# Altium schematic sheet Sheet1.SchDoc
size 420 x 297 mm
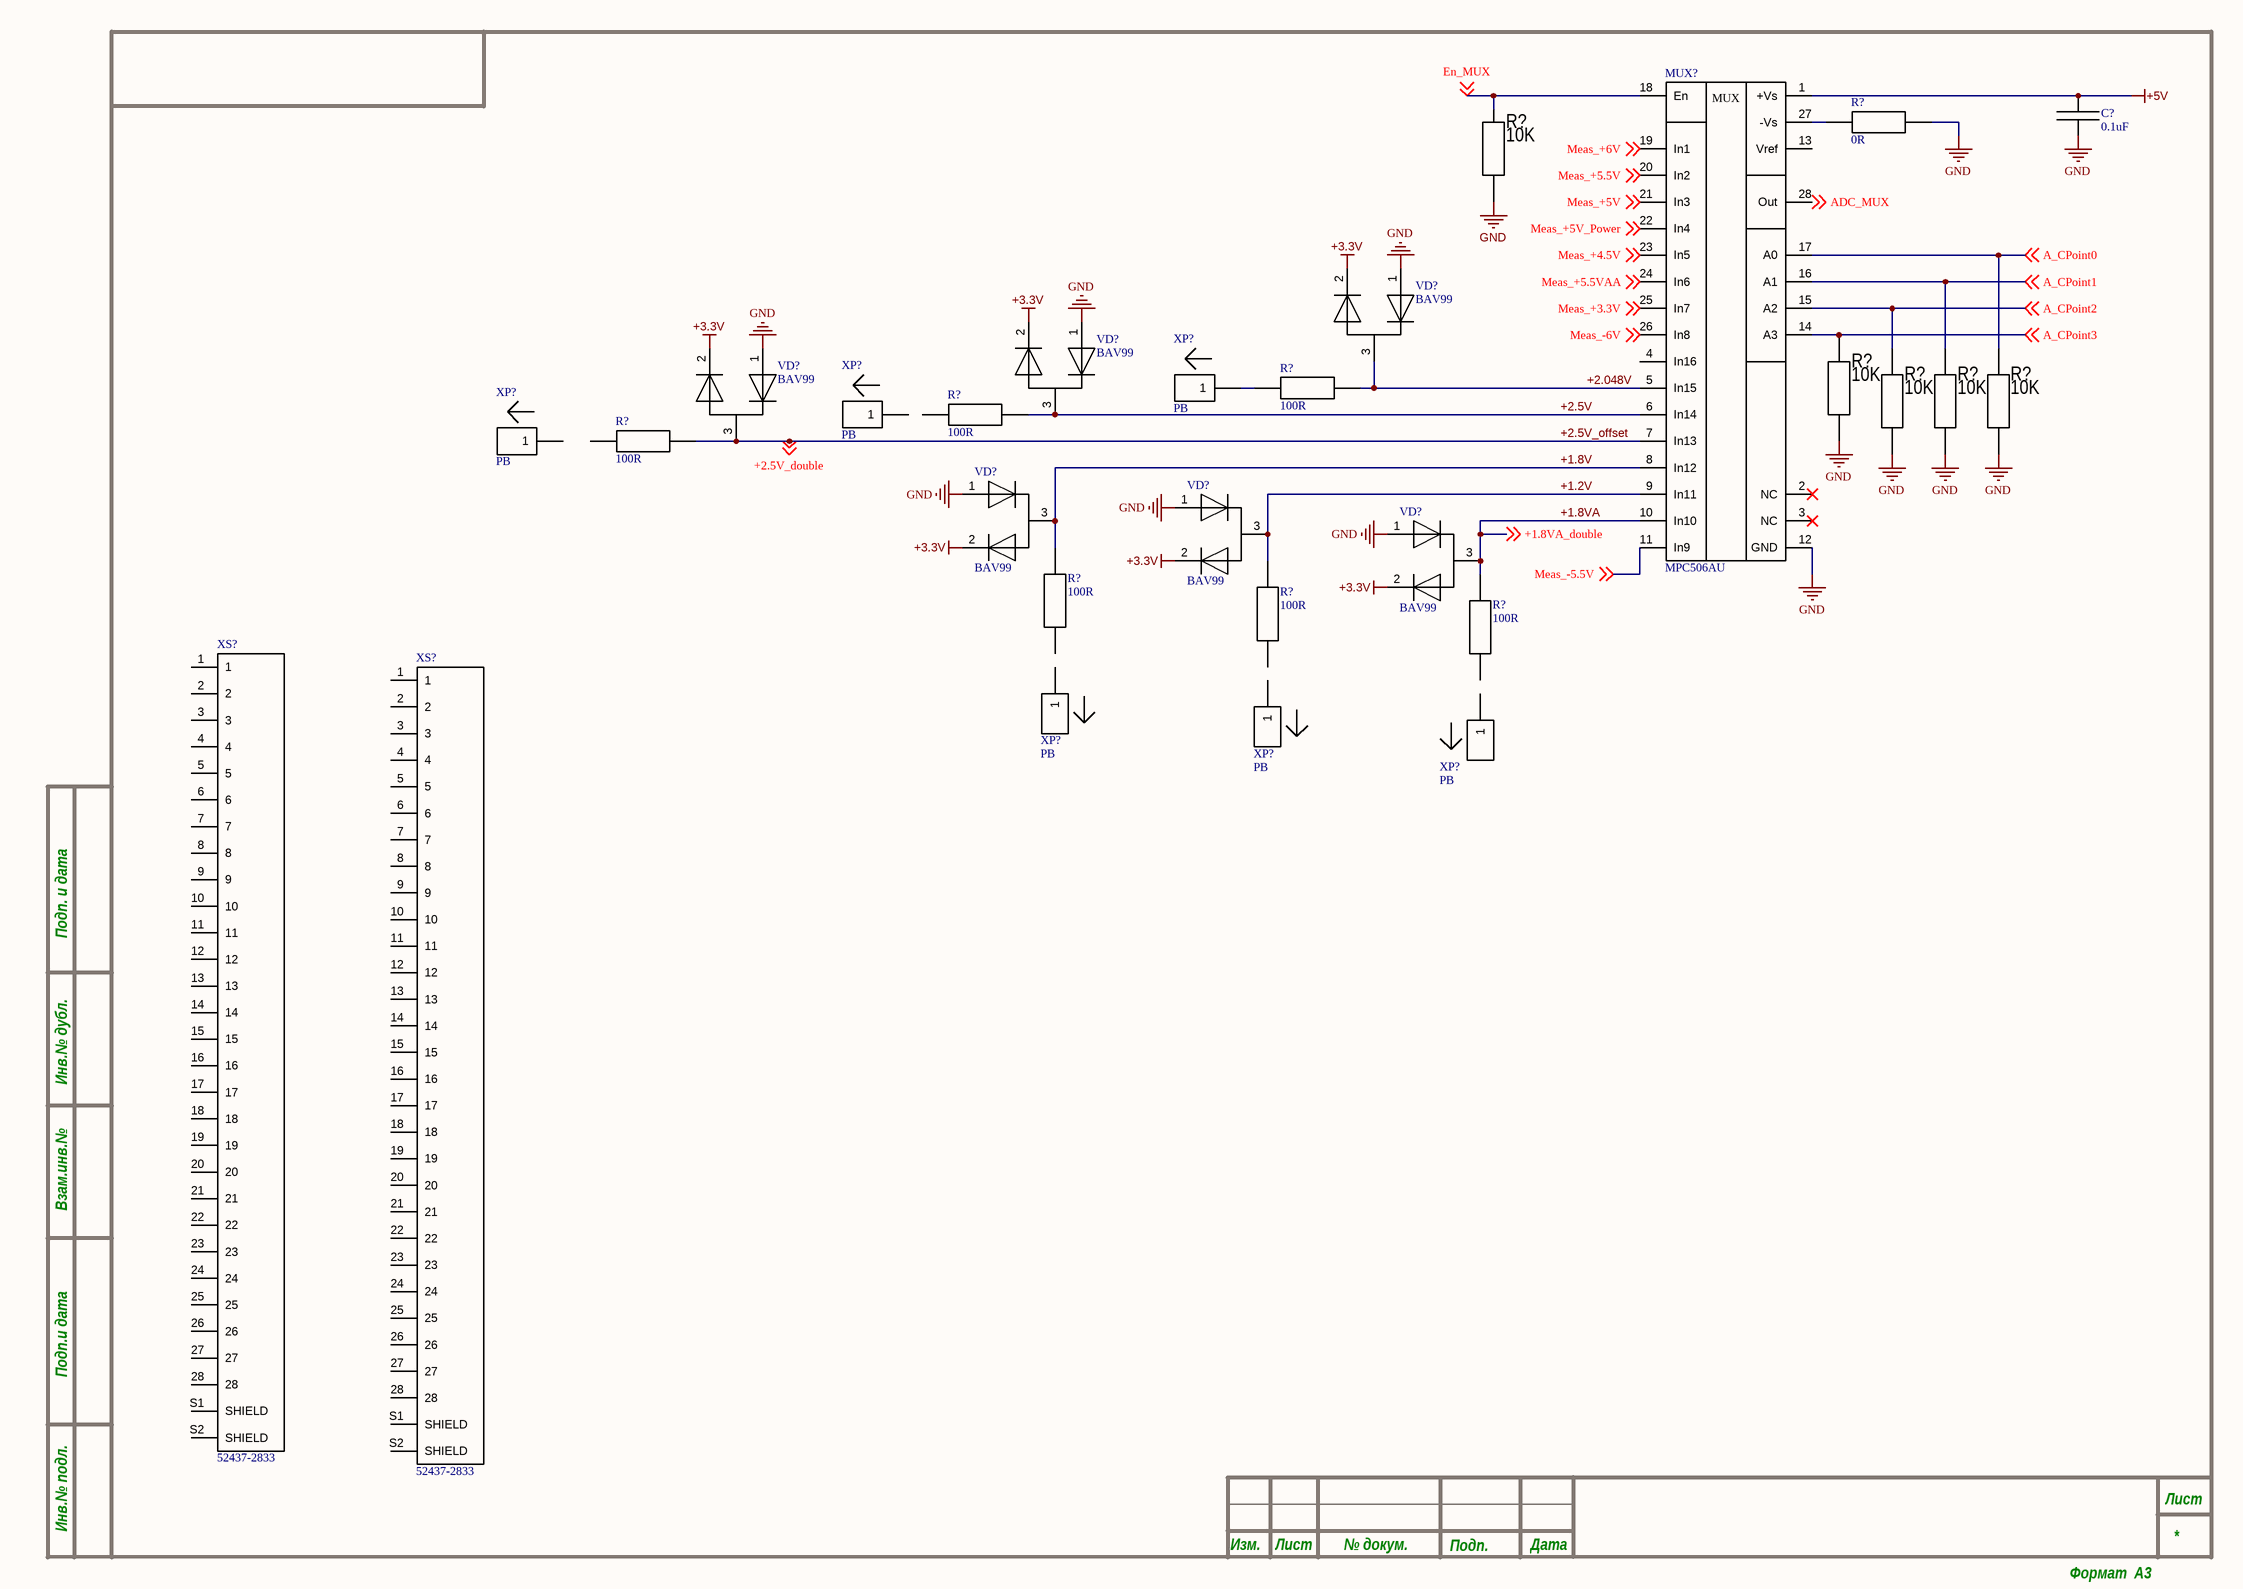
[diagram p0: Sheet1.SchDoc]

## Parts
(Parts that share a designator on the sheet are numbered #1, #2 ... from top to bottom, then left to right.)
C?  0.1uF  [0805C]
MUX?  MPC506AU  [SOIC-28]
R?#1  10K  [R0402]
R?#2  0R  [R0402]
R?#3  100R  [R0402]
R?#4  100R  [R0402]
R?#5  100R  [R0402]
R?#6  10K  [R0402]
R?#7  10K  [R0402]
R?#8  10K  [R0402]
R?#9  10K  [R0402]
R?#10  100R  [R0402]
R?#11  100R  [R0402]
R?#12  100R  [R0402]
VD?#1  BAV99  [SOT-23-3]
VD?#2  BAV99  [SOT-23-3]
VD?#3  BAV99  [SOT-23-3]
VD?#4  BAV99  [SOT-23-3]
VD?#5  BAV99  [SOT-23-3]
VD?#6  BAV99  [SOT-23-3]
XP?#1  PB  [POGO PIN P100-A2/B1]
XP?#2  PB  [POGO PIN P100-A2/B1]
XP?#3  PB  [POGO PIN P100-A2/B1]
XP?#4  PB  [POGO PIN P100-A2/B1]
XP?#5  PB  [POGO PIN P100-A2/B1]
XP?#6  PB  [POGO PIN P100-A2/B1]
XS?#1  52437-2833  [MOLEX_52437-2833]
XS?#2  52437-2833  [MOLEX_52437-2833]

## Nets
+3.3V: VD?#1.2 VD?#2.2 VD?#3.2 VD?#4.2 VD?#5.2 VD?#6.2
+5V: C?.1 MUX?.1(+Vs)
GND: C?.2 MUX?.12(GND) R?#1.2 R?#2.1 R?#6.1 R?#7.1 R?#8.1 R?#9.1 VD?#1.1 VD?#2.1 VD?#3.1 VD?#4.1 VD?#5.1 VD?#6.1
+1.2V: MUX?.9(In11) R?#11.2 VD?#5.3
+1.8V: MUX?.8(In12) R?#10.2 VD?#4.3
+1.8VA: MUX?.10(In10) R?#12.2 VD?#6.3 ; off-sheet +1.8VA_double  [also labelled +1.8VA_double]
+2.5V: MUX?.6(In14) R?#4.2 VD?#2.3
+2.5V_offset: MUX?.7(In13) R?#5.2 VD?#3.3 ; off-sheet +2.5V_double  [also labelled +2.5V_double]
+2.048V: MUX?.5(In15) R?#3.2 VD?#1.3
A_CPoint0: MUX?.17(A0) R?#9.2 ; off-sheet A_CPoint0
A_CPoint1: MUX?.16(A1) R?#8.2 ; off-sheet A_CPoint1
A_CPoint2: MUX?.15(A2) R?#7.2 ; off-sheet A_CPoint2
A_CPoint3: MUX?.14(A3) R?#6.2 ; off-sheet A_CPoint3
ADC_MUX: MUX?.28(Out) ; off-sheet ADC_MUX
En_MUX: MUX?.18(En) R?#1.1 ; off-sheet En_MUX
Meas_+3.3V: MUX?.25(In7) ; off-sheet Meas_+3.3V
Meas_+4.5V: MUX?.23(In5) ; off-sheet Meas_+4.5V
Meas_+5.5V: MUX?.20(In2) ; off-sheet Meas_+5.5V
Meas_+5.5VAA: MUX?.24(In6) ; off-sheet Meas_+5.5VAA
Meas_+5V: MUX?.21(In3) ; off-sheet Meas_+5V
Meas_+5V_Power: MUX?.22(In4) ; off-sheet Meas_+5V_Power
Meas_+6V: MUX?.19(In1) ; off-sheet Meas_+6V
Meas_-5.5V: MUX?.11(In9) ; off-sheet Meas_-5.5V
Meas_-6V: MUX?.26(In8) ; off-sheet Meas_-6V
NetMUX?_27: MUX?.27(-Vs) R?#2.2
NetR?#3_1: R?#3.1 XP?#1.1

Not connected (* = marked no-connect by the designer): MUX? 2(NC)* 3(NC)* 4(In16) 13(Vref); R?#4 1; R?#5 1; R?#10 1; R?#11 1; R?#12 1; XP?#2 1; XP?#3 1; XP?#4 1; XP?#5 1; XP?#6 1; XS?#1 1 2 3 4 5 6 7 8 9 10 11 12 13 14 15 16 17 18 19 20 21 22 23 24 25 26 27 28 S1(SHIELD) S2(SHIELD); XS?#2 1 2 3 4 5 6 7 8 9 10 11 12 13 14 15 16 17 18 19 20 21 22 23 24 25 26 27 28 S1(SHIELD) S2(SHIELD)

## Notes on the sheet
- Подп. и дата
- Инв.№ дубл.
- Взам.инв.№
- Подп.и дата
- Инв.№ подл.
- Изм.
- Лист
- № докум.
- Подп.
- Дата
- Формат  A3
- (in symbol MPC506AU) MUX

## Library data of the parts
C? = C0805-0.1UF 10% 50V: C0805 0.1UF 10% 50V; Part Number: SMD CAP CER 0.1UF ±10% 50V X7R 0805; Added_by: anton@teslatec.ru; Solder_Amount: 2; Pkg: 0805; Created_at: 10/01/2023; MountType: SMD; Mount: MOUNT
MUX? = MPC506AU: MPC506AU, Ch: 16, SO28; Added_by: irdolgopolowa@yandex.ru; Solder Amount: 28; Mount: Mount; MountType: SMD/SMT; Part Number: MPC506A; Package: SOIC; Created_at: 29/10/2024
R?#1 R?#6-R?#9 = R0402-10K: Resistor SMD 10K 1% 0402; Part Number: SMD RES 10 KOHM 1% ±100ppm/°C 0402; Added_by: Rutel@teslatec.ru; Solder_Amount: 2; Pkg: 0402; Created_at: 21/04/2020; MountType: SMD; Mount: MOUNT
R?#2 = R0402-0R: Resistor SMD 0R 1% 0402; Part Number: SMD RES 0R 0402; Added_by: irdolgopolowa@yandex.ru; Solder_Amount: 2; Pkg: 0402; Created_at: 29/10/24; MountType: SMD; Mount: MOUNT
R?#3-R?#5 R?#10-R?#12 = R0402-100R: Resistor SMD 100R 1% 0402; Part Number: SMD RES 100 OHM 1% ±100ppm/°C 0402; Added_by: irdolgopolowa@yandex.ru; Solder_Amount: 2; Pkg: 0402; Created_at: 29/10/24; MountType: SMD; Mount: MOUNT
VD?#1-VD?#6 = BAV99: BAV99, UMW, 70В, 200мА; Added_by: andrew@teslatec.ru; Solder_Amount: 3; Created_at: 29/06/2020; Mount: MOUNT; MountType: SMD; Pkg: SOT-23-3; Part Number: BAV99
XP?#1-XP?#6 = P100-B1: Pogo pin, 33.35x1.36; Added_by: irdolgopolowa@yandex.ru; Created_at: 29/10/24; Mount: MOUNT; MountType: THM; Part Number: P100-B1; Pkg: *
XS?#1 XS?#2 = 52437-2833: 28 Position FFC, FPC Connector Contacts, Bottom 0.020 _0.50mm_ Surface Mount, Right Angle; Part Number: 52437-2833 (MOLEX); Solder_Amount: 30; Added_by: ridel_av@teslatec.ru; Mount: MOUNT; MountType: SMD; Pkg: 52437-2833